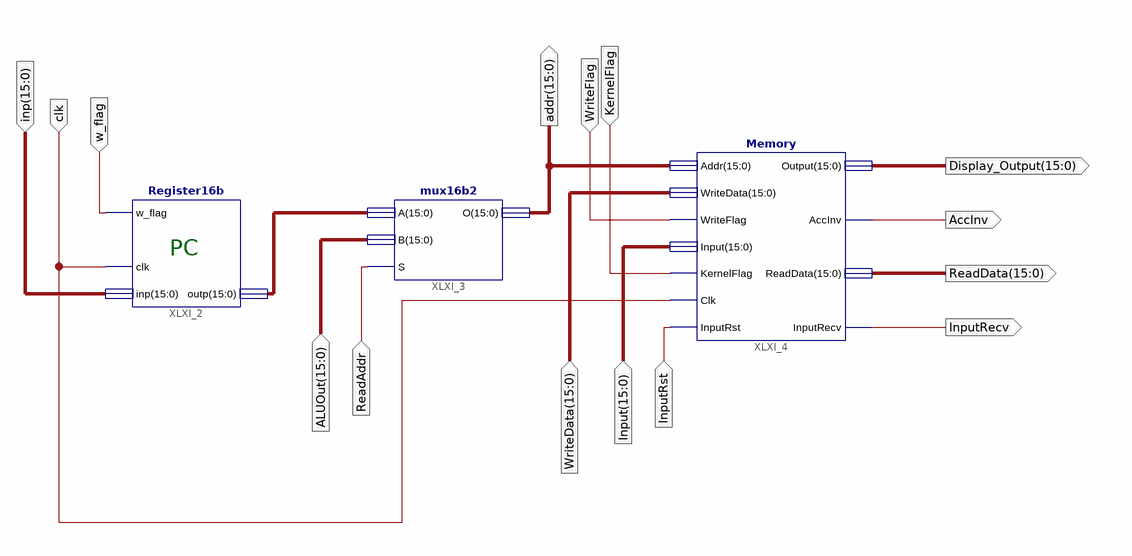
[diagram p0: schematic sheet 1]
// Xilinx ISE schematic PC_Mem_Unit.sch (artix7) as structural Verilog: 3 symbols, 15 ports
module PC_Mem_Unit (
  input  w_flag,
  input  clk,
  input  [15:0] inp,
  input  [15:0] ALUOut,
  input  ReadAddr,
  input  KernelFlag,
  input  InputRst,
  input  [15:0] Input,
  input  WriteFlag,
  input  [15:0] WriteData,
  output [15:0] addr,
  output [15:0] Display_Output,
  output InputRecv,
  output [15:0] ReadData,
  output AccInv
);

  wire [15:0] XLXN_4;

  Register16b XLXI_2 (.w_flag(w_flag), .clk(clk), .inp(inp), .outp(XLXN_4));
  mux16b2 XLXI_3 (.A(XLXN_4), .B(ALUOut), .S(ReadAddr), .O(addr));
  Memory XLXI_4 (
    .Addr(addr), .WriteData(WriteData), .WriteFlag(WriteFlag), .Input(Input), .KernelFlag(KernelFlag),
    .Clk(clk), .InputRst(InputRst), .Output(Display_Output), .AccInv(AccInv), .ReadData(ReadData),
    .InputRecv(InputRecv));

  // Notes on the sheet:
  //   PC
endmodule
